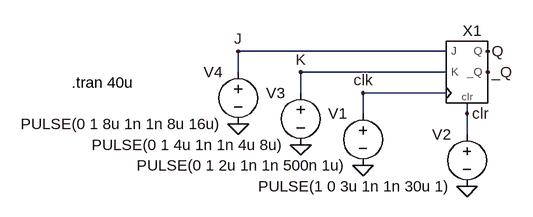
[diagram p0: schematic test-JKflipflop.asc]
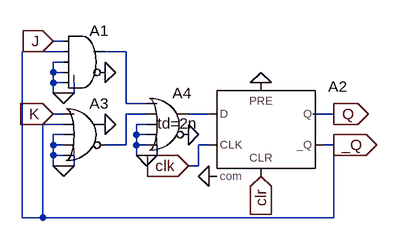
[diagram p1: sub-circuit jkflipflop.asc]
test-JKflipflop.asc, the LTspice schematic file:
Version 4
SHEET 1 1396 984
WIRE 176 192 -144 192
WIRE -144 224 -144 192
WIRE 176 224 -48 224
WIRE -48 256 -48 224
WIRE 176 256 48 256
WIRE 48 288 48 256
WIRE 208 288 208 272
WIRE 208 320 208 288
FLAG 48 368 0
FLAG 48 256 clk
FLAG 240 192 Q
FLAG 240 224 _Q
FLAG 208 400 0
FLAG 208 288 clr
FLAG -48 336 0
FLAG -48 224 K
FLAG -144 304 0
FLAG -144 192 J
SYMBOL voltage 48 272 M0
WINDOW 123 0 0 Left 0
WINDOW 39 0 0 Left 0
SYMATTR InstName V1
SYMATTR Value PULSE(0 1 2u 1n 1n 500n 1u)
SYMBOL voltage 208 304 M0
WINDOW 123 0 0 Left 0
WINDOW 39 0 0 Left 0
SYMATTR InstName V2
SYMATTR Value PULSE(1 0 3u 1n 1n 30u 1)
SYMBOL voltage -48 240 M0
WINDOW 123 0 0 Left 0
WINDOW 39 0 0 Left 0
SYMATTR InstName V3
SYMATTR Value PULSE(0 1 4u 1n 1n 4u 8u)
SYMBOL voltage -144 208 M0
WINDOW 123 0 0 Left 0
WINDOW 39 0 0 Left 0
SYMATTR InstName V4
SYMATTR Value PULSE(0 1 8u 1n 1n 8u 16u)
SYMBOL JKflipflop 208 240 R0
WINDOW 0 8 -64 Bottom 2
SYMATTR InstName X1
TEXT -400 240 Left 2 !.tran 40u

jkflipflop.asc, the sub-circuit schematic file:
Version 4
SHEET 1 1396 984
WIRE 288 128 272 128
WIRE 288 144 224 144
WIRE 384 144 352 144
WIRE 288 160 272 160
WIRE 272 176 272 160
WIRE 288 176 272 176
WIRE 272 192 272 176
WIRE 288 192 272 192
WIRE 272 208 272 192
WIRE 288 208 272 208
WIRE 304 208 304 192
WIRE 304 208 288 208
WIRE 384 224 384 144
WIRE 416 224 384 224
WIRE 288 240 272 240
WIRE 416 240 384 240
WIRE 512 240 480 240
WIRE 704 240 672 240
WIRE 288 256 256 256
WIRE 416 256 400 256
WIRE 288 272 272 272
WIRE 400 272 400 256
WIRE 416 272 400 272
WIRE 272 288 272 272
WIRE 288 288 272 288
WIRE 384 288 384 240
WIRE 384 288 352 288
WIRE 400 288 400 272
WIRE 416 288 400 288
WIRE 512 288 496 288
WIRE 704 288 688 288
WIRE 272 304 272 288
WIRE 288 304 272 304
WIRE 400 304 400 288
WIRE 416 304 400 304
WIRE 432 304 432 288
WIRE 432 304 416 304
WIRE 272 320 272 304
WIRE 288 320 272 320
WIRE 304 320 304 304
WIRE 304 320 288 320
WIRE 496 320 496 288
WIRE 496 320 480 320
WIRE 224 400 224 144
WIRE 256 400 256 256
WIRE 256 400 224 400
WIRE 704 400 704 288
WIRE 704 400 256 400
FLAG 288 320 0
FLAG 288 208 0
FLAG 704 240 Q
IOPIN 704 240 Out
FLAG 704 288 _Q
IOPIN 704 288 Out
FLAG 272 128 J
IOPIN 272 128 In
FLAG 272 240 K
IOPIN 272 240 In
FLAG 592 336 clr
IOPIN 592 336 In
FLAG 352 176 0
FLAG 512 336 0
FLAG 592 192 0
FLAG 480 320 clk
IOPIN 480 320 In
FLAG 416 304 0
FLAG 480 272 0
FLAG 352 256 0
SYMBOL Digital\\and 320 96 R0
SYMATTR InstName A1
SYMBOL Digital\\dflop 592 192 R0
SYMATTR InstName A2
SYMBOL Digital\\or 448 192 R0
WINDOW 3 -15 63 Left 0
SYMATTR Value td=2n
SYMATTR InstName A4
SYMBOL Digital\\or 320 208 R0
SYMATTR InstName A3

The netlist it stands for:
* test-JKflipflop.asc
V1 clk 0 PULSE(0 1 2u 1n 1n 500n 1u)
V2 clr 0 PULSE(1 0 3u 1n 1n 30u 1)
V3 K 0 PULSE(0 1 4u 1n 1n 4u 8u)
V4 J 0 PULSE(0 1 8u 1n 1n 8u 16u)
XX1 clk clr J K _Q Q jkflipflop

* block symbol definitions
.subckt jkflipflop clk clr J K _Q Q
A1 J _Q 0 0 0 0 N001 0 AND
A2 N003 0 clk 0 clr _Q Q 0 DFLOP
A4 N001 N002 0 0 0 0 N003 0 OR td=2n
A3 K _Q 0 0 0 N002 0 0 OR
.ends jkflipflop

.tran 40u
.backanno
.end